# Altium schematic sheet 5-ADC.SCHDOC
size A4
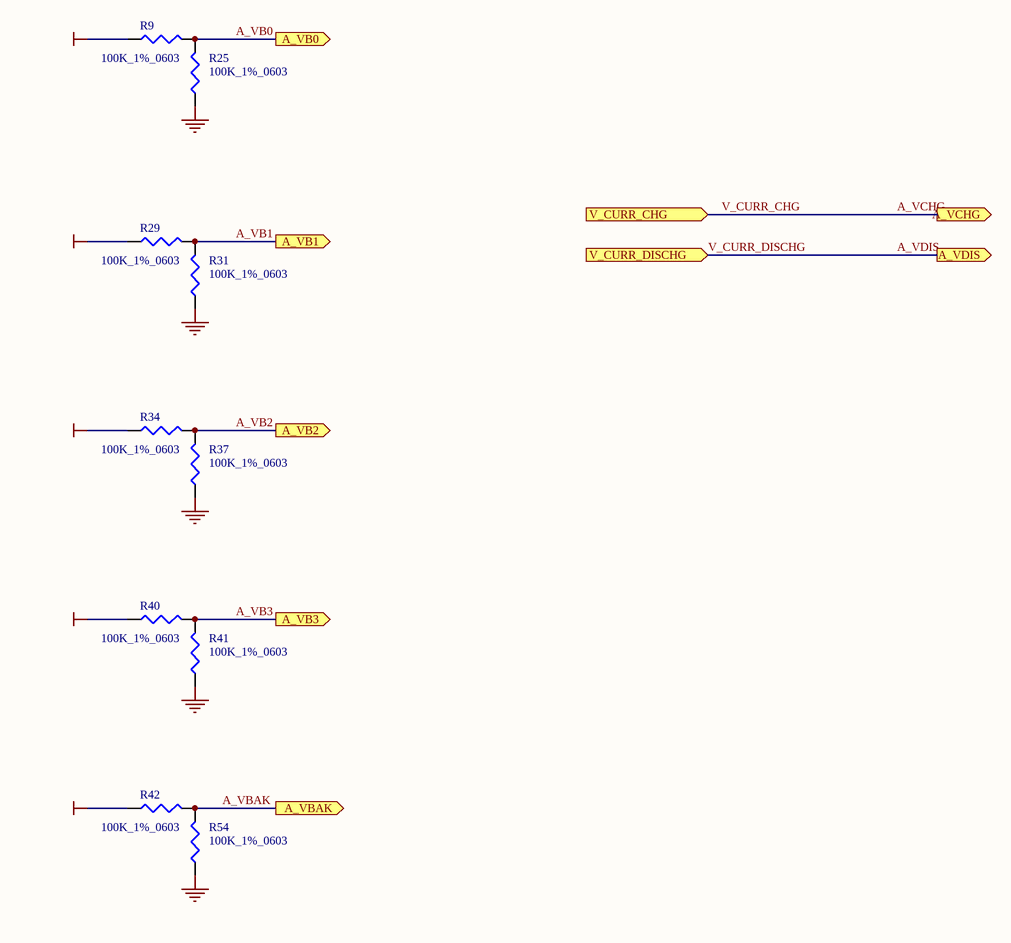
[diagram p0: 5-ADC.SCHDOC]

## Parts
R9  100K_1%_0603  [C1608-0603]
R25  100K_1%_0603  [C1608-0603]
R29  100K_1%_0603  [C1608-0603]
R31  100K_1%_0603  [C1608-0603]
R34  100K_1%_0603  [C1608-0603]
R37  100K_1%_0603  [C1608-0603]
R40  100K_1%_0603  [C1608-0603]
R41  100K_1%_0603  [C1608-0603]
R42  100K_1%_0603  [C1608-0603]
R54  100K_1%_0603  [C1608-0603]

## Ports
A_VB0 (out), A_VB1 (out), A_VB2 (out), A_VB3 (out), A_VBAK (out), A_VCHG (out), A_VDIS (out), V_CURR_CHG (in), V_CURR_DISCHG (in)

## Nets
GND: R25.1 R31.1 R37.1 R41.1 R54.1
V_BAK: R42.1
V_BT0: R9.1
V_BT1: R29.1
V_BT2: R34.1
V_BT3: R40.1
A_VB0: R9.2 R25.2 ; port A_VB0
A_VB1: R29.2 R31.2 ; port A_VB1
A_VB2: R34.2 R37.2 ; port A_VB2
A_VB3: R40.2 R41.2 ; port A_VB3
A_VBAK: R42.2 R54.2 ; port A_VBAK
A_VCHG: port A_VCHG, port V_CURR_CHG  [also labelled V_CURR_CHG]
A_VDIS: port A_VDIS, port V_CURR_DISCHG  [also labelled V_CURR_DISCHG]

## Library data of the parts
R9 R25 R29 R34 R40-R42 R54 = Res3: Resistor; Value: 100K 1% 0603; Published: 8-Jun-2000; Revision: July-2002: Re-released for DXP Platform.; Publisher: Altium Limited
R31 R37 = Res3: Resistor; Published: 8-Jun-2000; Revision: July-2002: Re-released for DXP Platform.; Publisher: Altium Limited; Value: 100K_1%_0603